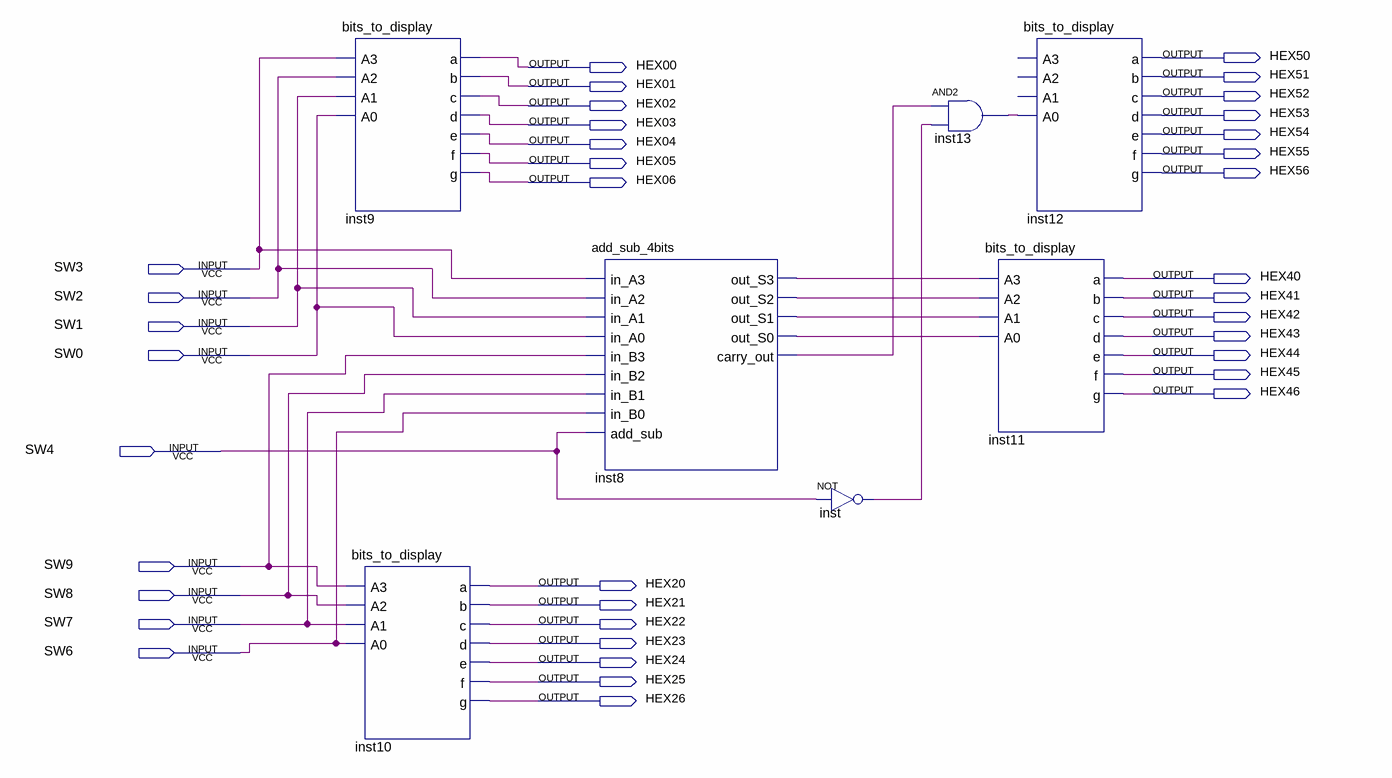
[diagram p0: schematic sheet]
// Quartus schematic LAB1.bdf as structural Verilog: 7 symbols, 37 pins
module LAB1 (
  input  SW3,
  input  SW2,
  input  SW1,
  input  SW0,
  input  SW4,
  input  SW9,
  input  SW8,
  input  SW7,
  input  SW6,
  output HEX50,
  output HEX00,
  output HEX51,
  output HEX01,
  output HEX52,
  output HEX02,
  output HEX53,
  output HEX03,
  output HEX54,
  output HEX04,
  output HEX55,
  output HEX05,
  output HEX56,
  output HEX06,
  output HEX40,
  output HEX41,
  output HEX42,
  output HEX43,
  output HEX44,
  output HEX45,
  output HEX46,
  output HEX20,
  output HEX21,
  output HEX22,
  output HEX23,
  output HEX24,
  output HEX25,
  output HEX26
);

  wire inst8_carry_out, inst8_out_s0, inst8_out_s1, inst8_out_s2, inst8_out_s3, inst13_out, inst_out;

  bits_to_display inst9 (
    .A3(SW3), .A2(SW2), .A1(SW1), .A0(SW0), .a(HEX00), .b(HEX01), .c(HEX02), .d(HEX03), .e(HEX04), .f(HEX05),
    .g(HEX06));
  bits_to_display inst10 (
    .A3(SW9), .A2(SW8), .A1(SW7), .A0(SW6), .a(HEX20), .b(HEX21), .c(HEX22), .d(HEX23), .e(HEX24), .f(HEX25),
    .g(HEX26));
  add_sub_4bits inst8 (
    .in_A3(SW3), .in_A2(SW2), .in_A1(SW1), .in_A0(SW0), .in_B3(SW9), .in_B2(SW8), .in_B1(SW7), .in_B0(SW6),
    .add_sub(SW4), .out_S3(inst8_out_s3), .out_S2(inst8_out_s2), .out_S1(inst8_out_s1),
    .out_S0(inst8_out_s0), .carry_out(inst8_carry_out));
  not inst (inst_out, SW4);
  and inst13 (inst13_out, inst8_carry_out, inst_out);
  bits_to_display inst12 (
    .A0(inst13_out), .a(HEX50), .b(HEX51), .c(HEX52), .d(HEX53), .e(HEX54), .f(HEX55), .g(HEX56));  // open: A3, A2, A1
  bits_to_display inst11 (
    .A3(inst8_out_s3), .A2(inst8_out_s2), .A1(inst8_out_s1), .A0(inst8_out_s0), .a(HEX40), .b(HEX41),
    .c(HEX42), .d(HEX43), .e(HEX44), .f(HEX45), .g(HEX46));
endmodule
